# Altium schematic sheet SV601272A-DAC.SchDoc
size 431 x 279 mm; Date: Not shown in title block; ApprovedBy: Not shown in title block; CheckedBy: Not shown in title block; Author: Not shown in title block; CompanyName: Not shown in title block; Engineer: Not shown in title block; Organization: Not shown in title block; Address1: Not shown in title block; Address2: Not shown in title block; Address3: Not shown in title block; Address4: Not shown in title block; DocumentNumber: 8; Revision: Use project parameter SCH_Rev; SheetNumber: 8; SheetTotal: 11; PageSetup: Record=PageOptions|CenterHorizontal=True|CenterVertical=True|PrintScale=1.00|XCorrection=1.00|YCorrection=1.00|PrintKind=0|BorderSize=5000000|LeftOffset=0|BottomOffset=0|Orientation=2|PaperLength=1000|PaperWidth=1000|Scale=100|PaperSource=15|PrintQuality=600|MediaType=1|DitherType=10|PaperKind=Letter|PrintScaleMode=1; CurrentTime: Not shown in title block; CurrentDate: Not shown in title block; Time: Not shown in title block; DocumentFullPathAndName: Not shown in title block; DocumentName: Not shown in title block; ModifiedDate: Not shown in title block; ImagePath: Not shown in title block
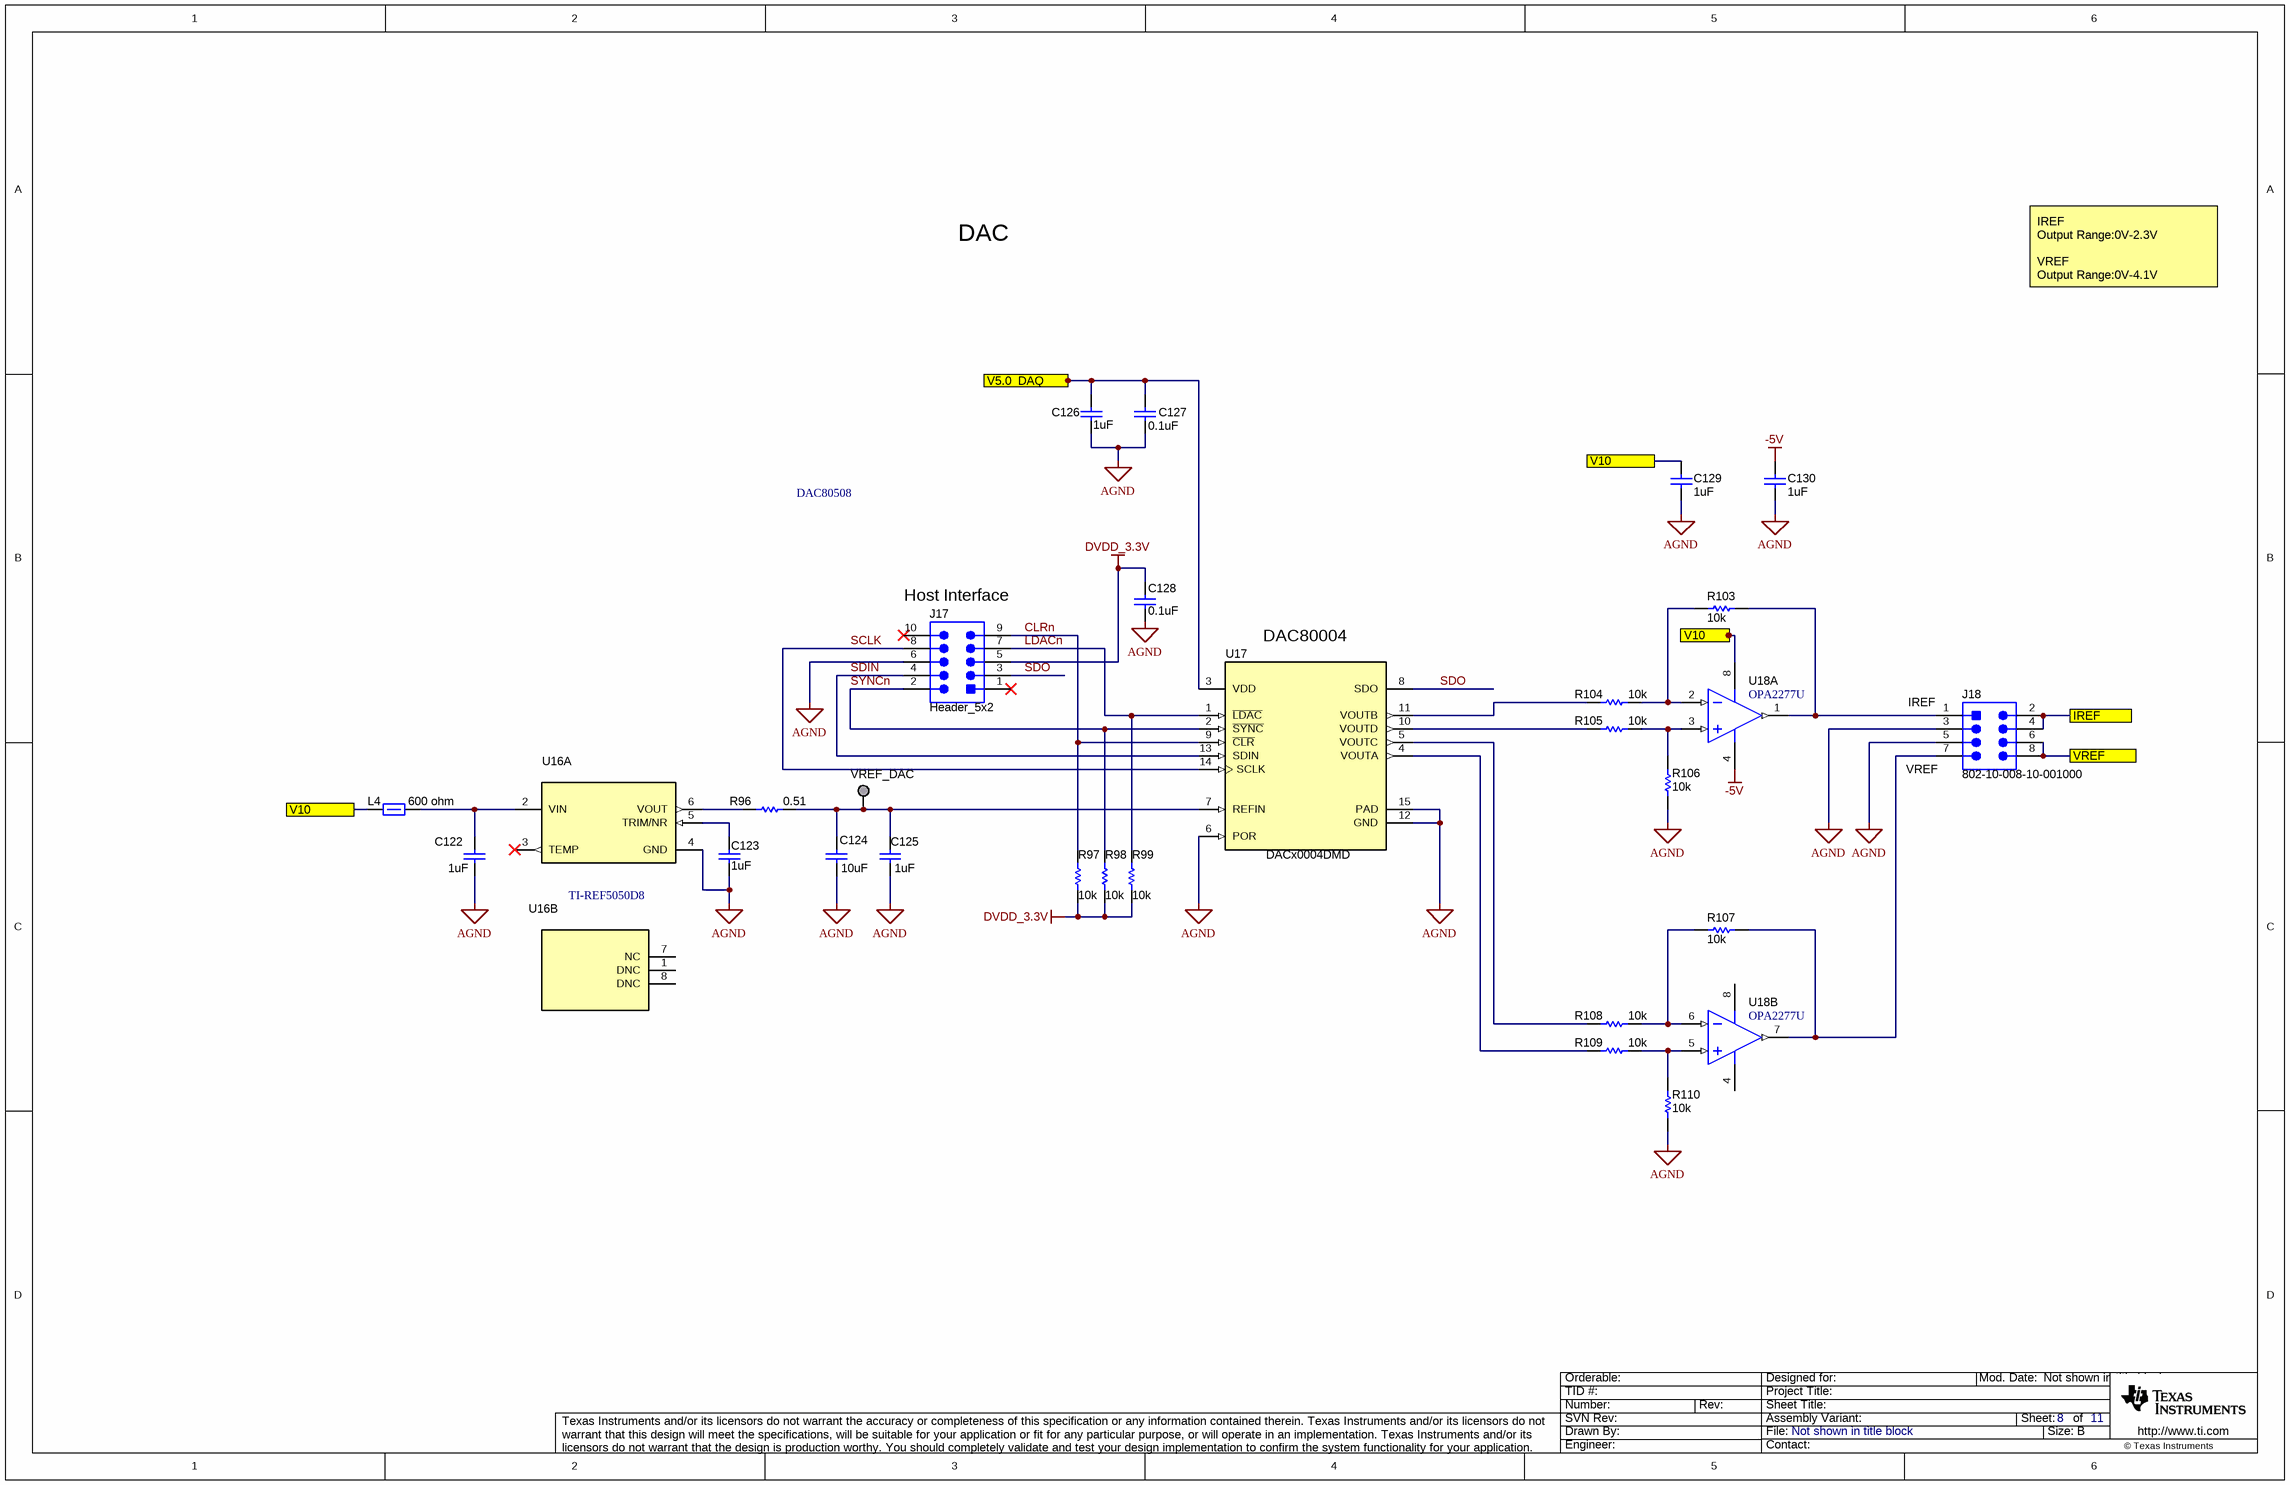
[diagram p0: SV601272A-DAC.SchDoc]

## Parts
C122  ValueDisplayed: 1uF  [1206]  (hidden comment: Capacitor)
C123  ValueDisplayed: 1uF  [1206]  (hidden comment: Capacitor)
C124  ValueDisplayed: 10uF  [0805_HV]  (hidden comment: Capacitor)
C125  ValueDisplayed: 1uF  [1206]  (hidden comment: Capacitor)
C126  ValueDisplayed: 1uF  [1206]  (hidden comment: Capacitor)
C127  ValueDisplayed: 0.1uF  [0603]  (hidden comment: Capacitor)
C128  ValueDisplayed: 0.1uF  [0603]  (hidden comment: Capacitor)
C129  ValueDisplayed: 1uF  [0603]  (hidden comment: Capacitor)
C130  ValueDisplayed: 1uF  [0603]  (hidden comment: Capacitor)
J17  Header_5x2  [Assman_AWHW-10G-0x02-T]
J18  802-10-008-10-001000  [Mill-Max_802-10-008-10-001000]
L4  value 600 ohm  [0603]  (hidden comment: Ferrite_Bead)
R96  ValueDisplayed: 0.51  [0603]  (hidden comment: Resistor)
R97  ValueDisplayed: 10k  [0603]  (hidden comment: Resistor)
R98  ValueDisplayed: 10k  [0603]  (hidden comment: Resistor)
R99  ValueDisplayed: 10k  [0603]  (hidden comment: Resistor)
R103  ValueDisplayed: 10k  [0603]  (hidden comment: Resistor)
R104  ValueDisplayed: 10k  [0603]  (hidden comment: Resistor)
R105  ValueDisplayed: 10k  [0603]  (hidden comment: Resistor)
R106  ValueDisplayed: 10k  [0603]  (hidden comment: Resistor)
R107  ValueDisplayed: 10k  [0603]  (hidden comment: Resistor)
R108  ValueDisplayed: 10k  [0603]  (hidden comment: Resistor)
R109  ValueDisplayed: 10k  [0603]  (hidden comment: Resistor)
R110  ValueDisplayed: 10k  [0603]  (hidden comment: Resistor)
U16  TI-REF5050D8  [D0008A_N]  (parts A,B of 2)
U17  DACx0004DMD  [DMD0014A]
U18  OPA2277U  [D0008A_N]  (parts A,B of 2)
VREF_DAC  Pogo Pad  [PogoPad]  (value not drawn)  (no BOM)

## Ports
IREF, V5.0_DAQ, V10, VREF

## Nets
-5V: C130.1 U18.4(V-)
AGND: C122.2 C123.2 C124.2 C125.2 C126.2 C127.2 C128.2 C129.2 C130.2 J17.6 J18.3 J18.5 R106.1 R110.1 U16.4(GND) U17.6(POR) U17.12(GND) U17.15(PAD)
DVDD_3.3V: C128.1 J17.5 R97.1 R98.1 R99.1
CLRn: J17.9 R97.2 U17.9(~{CLR})
IREF: J18.2 J18.4 ; port IREF
LDACn: J17.7 R99.2 U17.1(~{LDAC})
SCLK: J17.8 U17.14(SCLK)
SDIN: J17.4 U17.13(SDIN)
SDO: J17.3 U17.8(SDO)
SYNCn: J17.2 R98.2 U17.2(~{SYNC})
V5.0_DAQ: C126.1 C127.1 U17.3(VDD) ; port V5.0_DAQ
V10: C129.1 L4.1 U18.8(V+) ; port V10
VREF: J18.6 J18.8 ; port VREF
NetC122_1: C122.1 L4.2 U16.2(VIN)
NetC123_1: C123.1 U16.5(TRIM/NR)
NetC124_1: C124.1 C125.1 R96.2 U17.7(REFIN) VREF_DAC.1
NetJ18_1: J18.1 R103.1 U18.1(OUT_A)
NetJ18_7: J18.7 R107.1 U18.7(OUT_B)
NetR96_1: R96.1 U16.6(VOUT)
NetR103_2: R103.2 R104.1 U18.2(IN_A-)
NetR104_2: R104.2 U17.11(VOUTB)
NetR105_1: R105.1 R106.2 U18.3(IN_A+)
NetR105_2: R105.2 U17.10(VOUTD)
NetR107_2: R107.2 R108.1 U18.6(IN_B-)
NetR108_2: R108.2 U17.5(VOUTC)
NetR109_1: R109.1 R110.2 U18.5(IN_B+)
NetR109_2: R109.2 U17.4(VOUTA)

Not connected (* = marked no-connect by the designer): J17 1* 10*; U16 1(DNC) 3(TEMP)* 7(NC) 8(DNC)

## Notes on the sheet
- DAC
- IREF
  Output Range:0V-2.3V
  VREF
  Output Range:0V-4.1V
- DAC80508
- (near J17) Host Interface
- (near U17) DAC80004
- (near J18) IREF
- (near J18) VREF
- Drawn By:
- SVN Rev:
- Number:
- TID #:
- Orderable:
- Rev:
- Sheet Title:
- File:
- Project Title:
- Designed for:
- Assembly Variant:
- Mod. Date:
- Sheet:
- Size:
- of
- B
- http://www.ti.com
- Texas Instruments and/or its licensors do not warrant the accuracy or completeness of this specification or any information contained therein. Texas Instruments and/or its licensors do not warrant that this design will meet the specifications, will be suitable for your application or fit for any particular purpose, or will operate in an implementation. Texas Instruments and/or its licensors do not warrant that the design is production worthy. You should completely validate and test your design implementation to confirm the system functionality for your application.
- Engineer:
- Contact:
- © Texas Instruments

## Library data of the parts
C122 C123 C125 C126 = CMP-0008509-2: CAP, CERM, 1 uF, 25 V, +/- 10%, X7R, 1206; PartNumber: 12063C105KAT2A; Manufacturer: AVX; Polarized: N; Value: 1uF; U/M: EA; Cap_F: 1µF; ESR_ohm: 0.013; Value1: 0.013 ohm; VDC_V: 25V; TaMin_C: -55°C; TaMax_C: 125°C; SizeArea_mm2: 5.12; SizeAreaWB_mm2: 10.92; SizeX_mm: 3.2; SizeY_mm: 1.6; SizeZ_mm: 1.35; AEC Category: Q200; CompType: Capacitor; PackageReference: 1206; RoHS: Y; Tolerance_%: 10%; Value2: 25V; MountType: SMT; Technology: Ceramic; TempCo: X7R; Cap_Case: 1206; Published: 2008-06-19; Publisher: Texas Instruments; LatestRevisionDate: 2017-03-09; ComponentLink1Description: Datasheet link; ComponentLink1URL: http://datasheets.avx.com/X7RDielectric.pdf; Supplier 1: Digi-Key; Supplier Part Number 1: 478-1567-1-ND; Supplier 2: Newark; Supplier Part Number 2: 96K4787; Supplier 3: Mouser; Supplier Part Number 3: 581-12063C105K; AEC Qualified: N; AEC Grade: N/A
C124 = CMP-0008273-1: CAP, CERM, 10 uF, 35 V, +/- 10%, X6S, 0805; PartNumber: GRM21BC8YA106KE11L; Manufacturer: MuRata; Polarized: N; Value: 10uF; U/M: EA; Cap_F: 10µF; Value1: Unknown; VDC_V: 35V; TaMin_C: -55°C; TaMax_C: 105°C; Cap_Case: 0805; SizeArea_mm2: 2.5; SizeAreaWB_mm2: 6.75; SizeX_mm: 2; SizeY_mm: 1.25; SizeZ_mm: 1.45; AEC Category: Q200; CompType: Capacitor; PackageReference: 0805; RoHS: Y; Tolerance_%: 10%; Value2: 35V; MountType: SMT; Technology: Ceramic; TempCo: X6S; Published: 2008-06-19; Publisher: Texas Instruments; LatestRevisionDate: 2017-03-09; ComponentLink1Description: Datasheet link; ComponentLink1URL: http://search.murata.co.jp/Ceramy/image/img/A01X/G101/ENG/GRM21BC8YA106KE11-01.pdf; Supplier 1: Digi-Key; Supplier Part Number 1: 490-10504-1-ND; Supplier 2: Newark; Supplier Part Number 2: 96Y9269; Supplier 3: Mouser; Supplier Part Number 3: 81-GRM21BC8YA106KE1L; AEC Qualified: N; AEC Grade: N/A
C127 C128 = CMP-0006857-4: CAP, CERM, 0.1 uF, 16 V, +/- 5%, X7R, 0603; PartNumber: C0603C104J4RACTU; Manufacturer: Kemet; Polarized: N; Value: 0.1uF; U/M: EA; Cap_F: 100nF; Value1: Unknown; VDC_V: 16V; TaMin_C: -55°C; TaMax_C: 125°C; SizeArea_mm2: 1.28; SizeAreaWB_mm2: 4.68; SizeX_mm: 1.6; SizeY_mm: 0.8; SizeZ_mm: 1; AEC Category: Q200; CompType: Capacitor; PackageReference: 0603; RoHS: Y; Tolerance_%: 5%; Value2: 16V; MountType: SMT; Technology: Ceramic; TempCo: X7R; Cap_Case: 0603; Published: 2008-06-19; Publisher: Texas Instruments; LatestRevisionDate: 2017-03-09; ComponentLink1Description: Datasheet link; ComponentLink1URL: http://www.kemet.com/kemet/web/homepage/kechome.nsf/vapubfiles/F3102_Y5V.pdf/$file/F3102_Y5V.pdf; Supplier 1: Digi-Key; Supplier Part Number 1: 399-1097-1-ND; Supplier 2: Mouser; Supplier Part Number 2: 80-C0603C104J4R; Supplier 3: Farnell; Supplier Part Number 3: 1650834; AEC Qualified: ?
C129 C130 = CMP-0007067-4: CAP, CERM, 1 uF, 35 V, +/- 10%, X7R, AEC-Q200 Grade 1, 0603; PartNumber: CGA3E1X7R1V105K080AC; Manufacturer: TDK; Polarized: N; Value: 1uF; U/M: EA; Cap_F: 1µF; ESR_ohm: 5.522m; Value1: 0.005522 ohm; VDC_V: 35V; IRMS_A: 2.21617A; TaMin_C: -55°C; TaMax_C: 125°C; SizeArea_mm2: 1.28; SizeAreaWB_mm2: 4.68; SizeX_mm: 1.6; SizeY_mm: 0.8; SizeZ_mm: 1; AEC Category: Q200; AEC Qualified: Y; CompType: Capacitor; PackageReference: 0603; RoHS: Y; Tolerance_%: 10%; Value2: 35V; MountType: SMT; Technology: Ceramic; TempCo: X7R; Cap_Case: 0603; Published: 2008-06-19; Publisher: Texas Instruments; LatestRevisionDate: 2017-03-09; ComponentLink1Description: Datasheet link; ComponentLink1URL: https://product.tdk.com/en/search/capacitor/ceramic/mlcc/info?part_no=CGA3E1X7R1V105K080AC; Supplier 1: Digi-Key; Supplier Part Number 1: 445-174215-1-ND; Supplier 2: Mouser; Supplier Part Number 2: 810-CGA3E1X7R1V105K080AC; AEC Grade: 1
J17 = CMP-0075161-1: Header(Shrouded), 2.54mm, 5x2, Gold, TH; PartNumber: AWHW-10G-0202-T; Manufacturer: Assman WSW; Pitch_mm: 2.54; Gender: Male; Shrouded: Y; Row_Count: 2; CNHeader: False; Green_Lifecycle: Active; Green_REACh: Passed; PackageReference: Header, 2.54mm, 5x2, TH; CompType: Header; RoHS: Y; MountType: TH; ComponentLink1Description: Datasheet URL; ComponentLink1URL: http://www.assmann.us/specs/AWHW-xxG-0x02-T.pdf; Orientation: Vertical; PinCount: 10; RowSpacing_mm: 2.54; ContactFinish: Gold; Color: Gray; Publisher: Texas Instruments; LatestRevisionDate: 2017-07-12; Supplier 1: Digi-Key; Supplier Part Number 1: AWHW-10G-0202-T-ND; CT: False; Green_EU RoHS-2: Incomplete; Green_EU RoHS: Passed
J18 = CMP-0055096-1: Header, 2.54 mm, 4x2, Gold, TH; Manufacturer: Mill-Max; CNHeader: TRUE; Shrouded: N; Gender: Male; Row_Count: 2; RowSpacing_mm: 2.54; CT: FALSE; ComponentLink1URL: https://www.mill-max.com/assets/pdfs/metric/055M.PDF; ClassName: Header; Publisher: Texas Instruments; Color: Black; RoHS: Y; MountType: TH; Supplier 1: Digi-Key; PackageReference: Header, 2.54 mm, 4x2, TH; PinCount: 8; CompType: Header; LatestRevisionDate: 26/05/2017; PartNumber: 802-10-008-10-001000; Orientation: Vertical; ComponentLink1Description: Datasheet URL; Supplier Part Number 1: ED1309-08-ND; Pitch_mm: 2.54; ContactFinish: Gold
L4 = CMP-0003197-2: Ferrite Bead, 600 ohm @ 100 MHz, 1 A, 0603; PartNumber: 742792651; Manufacturer: Wurth Elektronik; Imax_A: 1A; DCR_ohm: 2d; Value1: 0.2 ohm; ZTyp@100MHz_Ohm: 600; Ztyp@1GHz_Ohm: 257.548; SizeArea_mm2: 1.28; SizeAreaWB_mm2: 4.68; SizeX_mm: 1.6; SizeY_mm: 0.8; SizeZ_mm: 1; CompType: Ferrite Bead; Value2: 1A; MountType: SMT; PackageReference: 0603; Published: 2014-04-30; Publisher: Texas Instruments; LatestRevisionDate: 2017-03-09; ComponentLink1Description: Datasheet link; ComponentLink1URL: http://katalog.we-online.de/pbs/datasheet/742792651.pdf; RoHS: Y; Supplier 1: Digi-Key; Supplier Part Number 1: 732-1593-1-ND; Supplier 2: Newark; Supplier Part Number 2: 08P2439; Supplier 3: Mouser; Supplier Part Number 3: 710-742792651; ValueDisplayed: 600 ohm
R96 = CMP-0022717-2: RES, 0.51, 1%, 0.1 W, AEC-Q200 Grade 1, 0603; PartNumber: ERJ-3RQFR51V; Manufacturer: Panasonic; Value: 0.51; Res_ohm: 5.1d; Value_Code: R510; Power_W: 100mW; Value2: 0.1W; TempCo: 300 ppm/C; SizeArea_mm2: 1.28; SizeX_mm: 1.6; SizeY_mm: 0.8; SizeZ_mm: 1; EIA_Code: E96; U/M: EA; AEC Category: Q200; AEC Qualified: Y; CompType: Resistor; PackageReference: 0603; RoHS: Y; Tolerance_%: 1%; Value1: 1%; MountType: SMT; Technology: Thick Film; Published: 2008-06-26; Publisher: Texas Instruments; LatestRevisionDate: 2017-03-09; ComponentLink1Description: Datasheet link; ComponentLink1URL: http://industrial.panasonic.com/www-data/pdf/AOA0000/AOA0000CE3.pdf; Supplier 1: Digi-Key; Supplier Part Number 1: P.51AJCT-ND; Supplier 2: Newark; Supplier Part Number 2: 51W9702; Supplier 3: Mouser; Supplier Part Number 3: 667-ERJ-3RQFR51V; AEC Grade: 1
R97-R99 R103-R110 = CMP-0025701-4: RES, 10 k, 5%, 0.1 W, AEC-Q200 Grade 0, 0603; PartNumber: CRCW060310K0JNEA; Manufacturer: Vishay-Dale; Value: 10k; Value_Code: 10k0; Power_W: 100mW; Value2: 0.1W; VDC_V: 75V; TempCo: 200 ppm/C; SizeArea_mm2: 1.28; SizeX_mm: 1.6; SizeY_mm: 0.8; SizeZ_mm: 1; EIA_Code: E24; AEC Category: Q200; AEC Qualified: Y; AEC Grade: 0; CompType: Resistor; PackageReference: 0603; RoHS: E; Res_ohm: 10k; Tolerance_%: 5%; Value1: 5%; MountType: SMT; Technology: Thick Film; ComponentLink1Description: Datasheet link; ComponentLink1URL: http://www.vishay.com/docs/20035/dcrcwe3.pdf; Supplier 1: Digi-Key; Supplier Part Number 1: 541-10KGCT-ND; Supplier 2: Newark; Supplier Part Number 2: 52K8066; Supplier 3: Mouser; Supplier Part Number 3: 71-CRCW0603J-10K-E3
U16 = CMP-0032617-1: Low Noise, Very Low Drift, Precision Voltage Reference, -40 to 125 degC, 8-pin SOIC (D), Green (RoHS & no Sb/Br); PartNumber: REF5050AID; Manufacturer: Texas Instruments; Initial Accuracy @ 25/deg C(%): 0.05; Iout/Iz(Max)(mA): 10; Iq(Max)(uA): 1000; Rating: Catalog; SubFamily: Series Voltage Reference; Temp Coeff(Max)(ppm/ degree C): 3; VI(Max)(V): 18; VI(Min)(V): 5.2; VO(V): 5; PackageReference: D0008A; PackageDescription: 8-Pin Plastic Small Outline, Body 4.9 x 3.9 mm, Pitch 1.27 mm; ComponentLink1Description: Manufacturer URL; ComponentLink1URL: http://www.ti.com/; Code_JEDEC: MS-012; ComponentLink2Description: Datasheet; ComponentLink2URL: http://www.ti.com/general/docs/lit/getliterature.tsp?genericPartNumber=REF5050&fileType=pdf; ComponentLink3Description: Package Specification; ComponentLink3URL: http://www.ti.com/litv/pdf/msoi002j; DatasheetVersion: SBOS410E; Eco-Plan: Green (RoHS & no Sb/Br); Mounting Technology: Surface Mount; PackageVersion: 4040047-3/M
U17 = CMP-0013342-2: QUAD 16-BIT, 1LSB INL, BUFFERED, VOLTAGE-OUTPUT DIGITAL-to-ANALOG CONVERTERS, DMD0014A (VSON-14); PartNumber: DAC80004IDMD; Manufacturer: Texas Instruments; SizeArea_mm2: 12; SizeAreaWB_mm2: 20; SizeX_mm: 3; SizeY_mm: 4; SizeZ_mm: 1; CompType: IC; U/M: EA; PackageReference: DMD0014A; PackageDescription: VSON-14; MountType: SMT; ComponentLink1Description: Datasheet Link; ComponentLink1URL: https://sps06.itg.ti.com/sites/KMS/crossdivteams/altium/docs/ComponentDatasheets/DAC80004.pdf; Publisher: Texas Instruments; LatestRevisionDate: 2017-03-09; Alternate Manufacturer: Texas Instruments
U18 = CMP-0040655-1: High Precision Operational Amplifier, 4 to 36 V, -40 to 85 degC, 8-pin SOIC (D8), Green (RoHS & no Sb/Br); Manufacturer: Texas Instruments; CMRR(Min)(dB): 130; GBW(Typ)(MHz): 1; IIB(Max)(pA): 1000; Iq per channel(Max)(mA): 0.825; Number of Channels: 2; Offset Drift(Typ)(uV/C): 0.1; Packing: TUBE; Rating: Catalog; Slew Rate(Typ)(V/us): 0.8; Sub Family: High Supply Voltage Amplifier (>=30V), Low Noise Amp (<=10nV/rtHz), Low Offset Voltage Amplifier (<=500uV), Precision Amplifier; Total Supply Voltage(Max)(+5V is 5, +/-5V is 10): 36; Total Supply Voltage(Min)(+5V is 5, +/-5V is 10): 4; Vio (25C)(Max)(mV): 0.025; DatasheetVersion: SBOS079A; PackageVersion: 4040047-3/M, 06/2011; PackageReference: D0008A; PackageDescription: 8-Pin Plastic Small Outline, Body 4.9 x 3.9 mm, Pitch 1.27 mm; Eco-Plan: Green (RoHS & no Sb/Br); Code_JEDEC: MS-012; PartNumber: OPA2277U; ComponentLink1Description: Manufacturer URL; ComponentLink1URL: http://www.ti.com/; ComponentLink2Description: Datasheet; ComponentLink2URL: http://www.ti.com/lit/ds/symlink/opa2277.pdf; ComponentLink3Description: Package Specification; ComponentLink3URL: http://www.ti.com/litv/pdf/msoi002j; Mounting Technology: Surface Mount
VREF_DAC = PogoPad: Pad for Pogo Pin Connector; SymbolCreator: codlsc; SymbolVersion: 2010-09-27; PackageReference: N/A; CompType: Pogo Pad; Publisher: Texas Instruments; LatestRevisionDate: 2016-12-05; LatestRevisionNote: Added Alternate PartNumber and Alternate Manufacturer parameters to appropriate components.